# Altium schematic sheet top_power.SchDoc: Electrical Power System - General Block Diagram - Power
size A4; Date: 2015-08-29; Author: Piotr Kuligowski; Revision: 1-0; SheetTotal: 14; Model: EM1; PageSetup: Record=PageOptions|CenterHorizontal=True|CenterVertical=True|PrintScale=0.52|XCorrection=1.00|YCorrection=1.00|PrintKind=1|BorderSize=5000000|LeftOffset=0|BottomOffset=0|Orientation=2|PaperLength=4200|PaperWidth=2970|Scale=100|PaperSource=7|PrintQuality=600|MediaType=1|DitherType=10|PaperKind=A3|PrintScaleMode=1
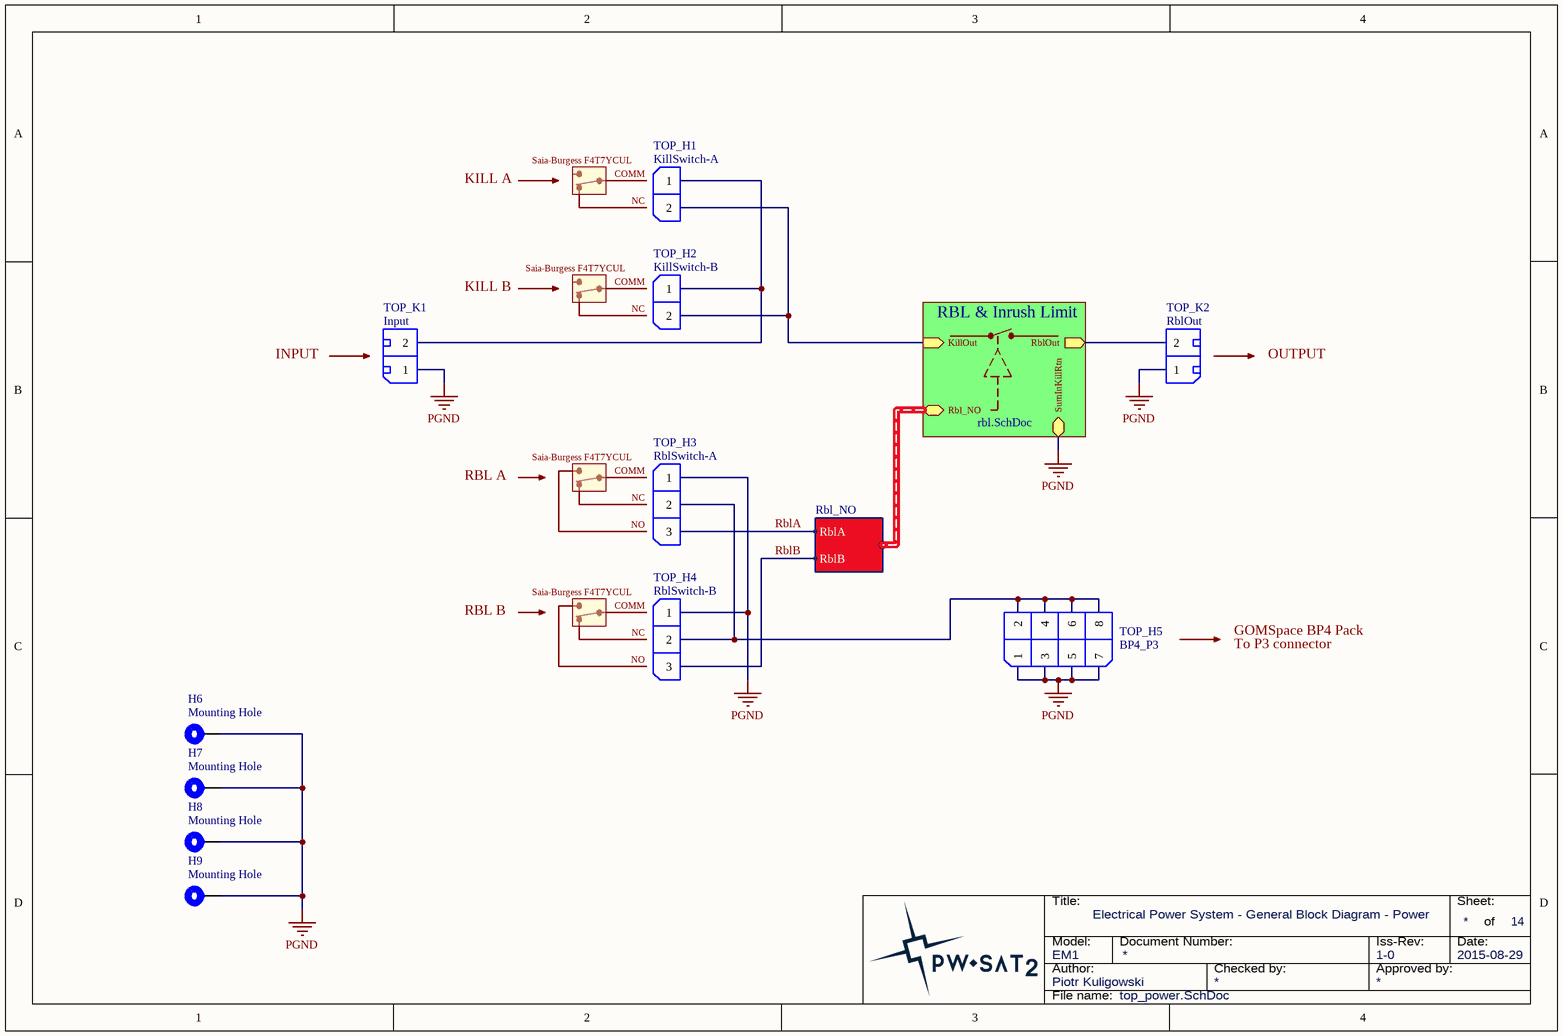
[diagram p0: top_power.SchDoc]

## Parts
H6  Mounting Hole  [PC-104_PcbMntHole_M3]
H7  Mounting Hole  [PC-104_PcbMntHole_M3]
H8  Mounting Hole  [PC-104_PcbMntHole_M3]
H9  Mounting Hole  [PC-104_PcbMntHole_M3]
TOP_H1  KillSwitch-A  [Harwin_Datamate_L-Tek_M80-8760205]
TOP_H2  KillSwitch-B  [Harwin_Datamate_L-Tek_M80-8760205]
TOP_H3  RblSwitch-A  [Harwin_Datamate_L-Tek_M80-8770305]
TOP_H4  RblSwitch-B  [Harwin_Datamate_L-Tek_M80-8770305]
TOP_H5  BP4_P3  [Harwin_Datamate_L-Tek_M80-8670805]
TOP_K1  ProviderPartNumber: Input  [TerminalBlock_Spring_2.54_2-R]  (hidden comment: TB-2.5-PD-xx)
TOP_K2  ProviderPartNumber: RblOut  [TerminalBlock_Spring_2.54_2-R]  (hidden comment: TB-2.5-PD-xx)

## Sub-sheets
RBL & Inrush Limit = rbl.SchDoc: RblOut (out), KillOut (in), SumInKillRtn, Rbl_NO (harness Rbl_NO)

## Harnesses
Rbl_NO: RblA, RblB

## Nets
PGND: H6.1 H7.1 H8.1 H9.1 TOP_H3.1 TOP_H4.1 TOP_H5.1 TOP_H5.3 TOP_H5.5 TOP_H5.7 TOP_K1.1 TOP_K2.1 ; sheet RBL & Inrush Limit/SumInKillRtn
RblA: TOP_H3.3 ; sheet RBL & Inrush Limit/Rbl_NO.RblA
RblB: TOP_H4.3 ; sheet RBL & Inrush Limit/Rbl_NO.RblB
NetTOP_H1_1: TOP_H1.1 TOP_H2.1 TOP_K1.2
NetTOP_H1_2: TOP_H1.2 TOP_H2.2 ; sheet RBL & Inrush Limit/KillOut
NetTOP_H3_2: TOP_H3.2 TOP_H4.2 TOP_H5.2 TOP_H5.4 TOP_H5.6 TOP_H5.8
NetTOP_K2_2: TOP_K2.2 ; sheet RBL & Inrush Limit/RblOut

## Notes on the sheet
- (near TOP_H1) Saia-Burgess F4T7YCUL
- (near TOP_H1) COMM
- KILL A
- (near TOP_H1) NC
- KILL B
- Saia-Burgess F4T7YCUL
- (near TOP_H2) COMM
- (near TOP_H2) NC
- INPUT
- OUTPUT
- RBL A
- (near TOP_H3) Saia-Burgess F4T7YCUL
- (near TOP_H3) COMM
- (near TOP_H3) NC
- (near TOP_H3) NO
- RBL B
- (near TOP_H4) COMM
- (near TOP_H4) NC
- GOMSpace BP4 Pack
- To P3 connector
- (near TOP_H4) NO
- Title:
- Sheet:
- of
- Author:
- Model:
- Document Number:
- Checked by:
- Iss-Rev:
- Approved by:
- Date:
- File name:

## Library data of the parts
H6-H9 = MntHole: PCB Mounting Hole; Value: Mounting Hole
TOP_H1 TOP_H2 = Harwin_Datamate_L-Tek_1x2pin: Harwin DataMate L-Tek, 2mm pitch, 1x2pin.; Value: Harwin DataMate L-Tek 1x2pin
TOP_H3 TOP_H4 = Harwin_Datamate_L-Tek_1x3pin: Harwin DataMate L-Tek, 2mm pitch, 1x3pin.; Value: Harwin DataMate L-Tek 1x3pin
TOP_H5 = Harwin_Datamate_L-Tek_2x4pin: Harwin DataMate L-Tek, 2mm pitch, 2x4pin.; Value: Harwin DataMate L-Tek 2x4pin
TOP_K1 TOP_K2 = TerminalBlock_Spring_2.54_2-R: Terminal block with spring, 2-pin, 2.54mm pitch, right angle.; Provider: TME.eu; Value: TB-2.5-PD-xx